# EAGLE design acdcconverter (EAGLE 7.5.0)
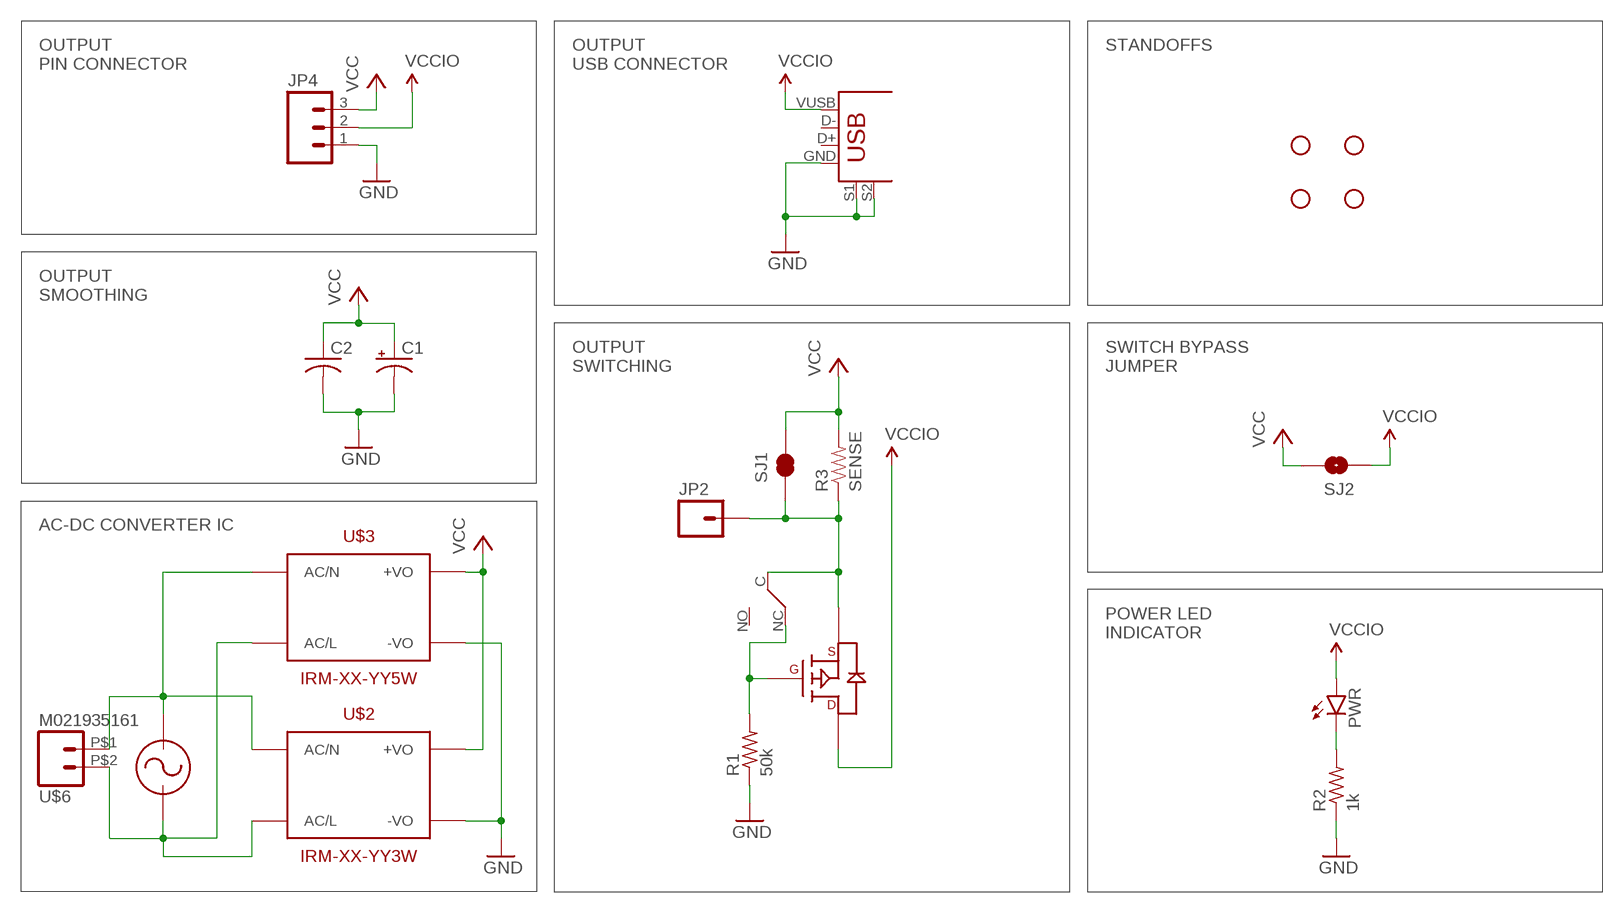
[diagram p0: schematic, sheet 1]

## Parts
C1  CPOL-USE2-5  [E2-5]
C2  C-USC0603  [C0603]
JP2  M01PTH  [1X01]
JP4  M03PTH  [1X03]
PWR  LED0603  [LED-0603]
R1  50k  R-US_R0603  [R0603]
R2  1k  R-US_R0603  [R0603]
R3  SENSE  RESISTOR0805-RES  [0805]
SJ1  JUMPER-PAD-2-NC_BY_TRACE  [PAD-JUMPER-2-NC_BY_TRACE_YES_SILK]
SJ2  SOLDERJUMPERNO  [SJ_2S-NO]
STANDOFF1  STAND-OFF  [STAND-OFF]
STANDOFF2  STAND-OFF  [STAND-OFF]
STANDOFF3  STAND-OFF  [STAND-OFF]
STANDOFF4  STAND-OFF  [STAND-OFF]
U$1  AC-CONNECTOR770W-X2  [770W-X2]
U$2  IRM-XX-YY3W  [IRM-03-YY]
U$3  IRM-XX-YY5W  [IRM-05-YY]
U$5  SWITCH-SPDT  [SWITCH-1825232-1]
U$6  M021935161  [M02-1935161]
U$7  USB-FEMALE  [FOXCONN-113N-USB-A-FEMALE]
U$8  MOSFET-PDMG2305UX  [SOT23-3]

## Nets
AC/L: U$1.P$1(AC1) U$2.AC/L U$3.AC/L U$6.P$2
AC/N: U$1.P$2(AC2) U$2.AC/N U$3.AC/N U$6.P$1
GND: C1.- C2.2 JP4.1 R1.1 R2.1 U$2.-VO U$3.-VO U$7.GND U$7.S1 U$7.S2
N$3: R1.2 U$5.NC U$8.3(GATE)
N$4: JP2.1 R3.1 SJ1.1 U$5.C U$8.1(SOURCE)
N$6: PWR.C R2.2
VCC: C1.+ C2.1 JP4.3 R3.2 SJ1.2 SJ2.2 U$2.+VO U$3.+VO
VCCIO: JP4.2 PWR.A SJ2.1 U$7.VUSB U$8.2(DRAIN)
Unconnected: U$5.NO U$7.D+ U$7.D-

## Notes on the sheet
- OUTPUT
  PIN CONNECTOR
- OUTPUT
  USB CONNECTOR
- STANDOFFS
- OUTPUT
  SMOOTHING
- OUTPUT
  SWITCHING
- SWITCH BYPASS
  JUMPER
- AC-DC CONVERTER IC
- POWER LED
  INDICATOR

## Library data of the parts
C1 = rcl:CPOL-US: POLARIZED CAPACITOR, American symbol
C2 = rcl:C-US: CAPACITOR, American symbol
JP2 = SparkFun-Connectors:M01: Header 1 Standard 1-pin 0.1" header. Use with straight break away headers (SKU : PRT-00116), right angle break away headers (PRT-00553), swiss pins (PRT-00743), machine pins (PRT-00117), and female headers (PRT-00115).
JP4 = SparkFun-Connectors:M03: Header 3 Standard 3-pin 0.1" header. Use with straight break away headers (SKU : PRT-00116), right angle break away headers (PRT-00553), swiss pins (PRT-00743), machine pins (PRT-00117), and female headers (PRT-00115). Molex polarized connector foot print use with SKU : PRT-08232 with associated crimp pins and housings.
PWR = SparkFun-LED:LED: LEDs Standard schematic elements and footprints for 5mm, 3mm, 1206, and 0603 sized LEDs. 5mm - Spark Fun Electronics SKU : COM-00529 (and others)
R1 R2 = resistor:R-US_: RESISTOR, American symbol
R3 = SparkFun-Passives:RESISTOR: Resistor Basic schematic elements and footprints for 0603, 1206, and PTH resistors.
SJ1 = SparkFun-Passives:JUMPER-PAD-2-NC_BY_TRACE
SJ2 = SparkFun-Retired:SOLDERJUMPER: Solder Jumper Standard SMD solder jumper. Used to automate production. Two varients : Normally Open and Normally Closed are the same, but have different paste layers. NC will have a large amount of paste and should jumper during reflow.
STANDOFF1-STANDOFF4 = SparkFun-Electromechanical:STAND-OFF: #4 Stand Off This is the mechanical footprint for a #4 phillips button head screw. Use the keepout ring to avoid running the screw head into surrounding components. SKU : PRT-00447
U$1 = HHJ:AC-CONNECTOR
U$2 U$3 = HHJ:IRM-XX-YY
U$5 = HHJ:SWITCH-SPDT
U$6 = HHJ:M02
U$7 = HHJ:USB-FEMALE
U$8 = HHJ:MOSFET-P

## Board
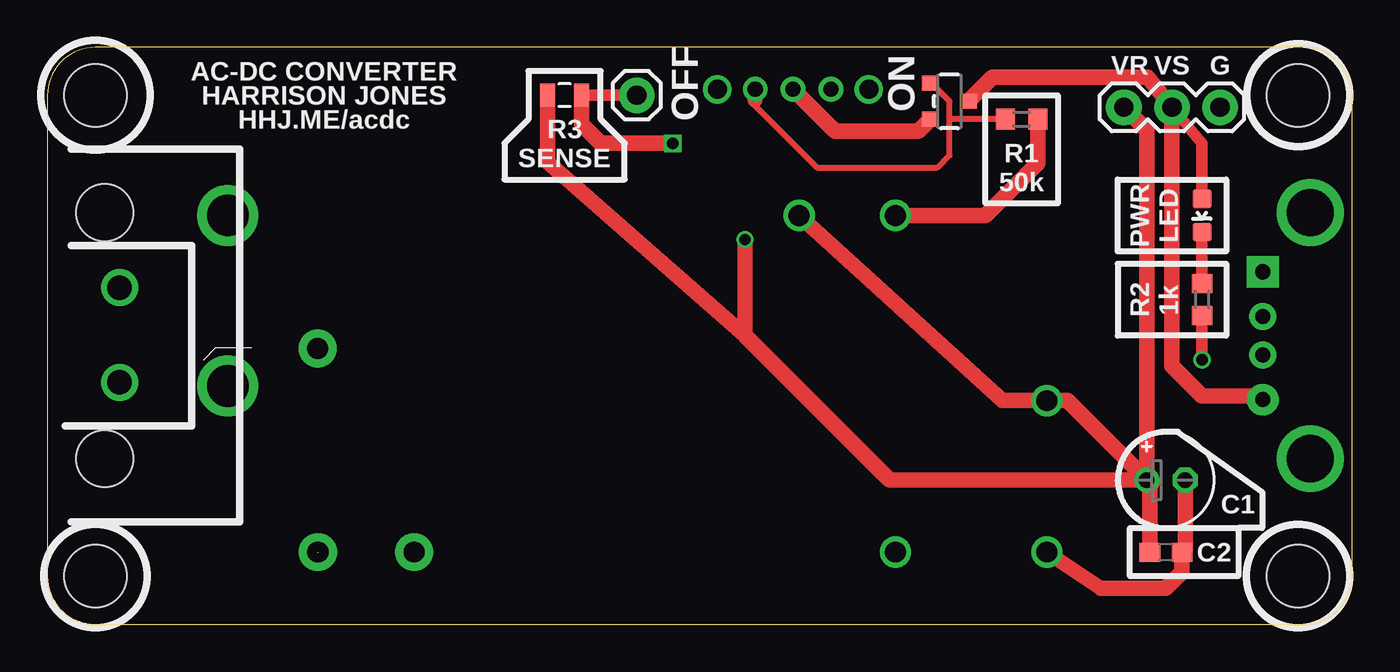
[diagram p1: board, top side]
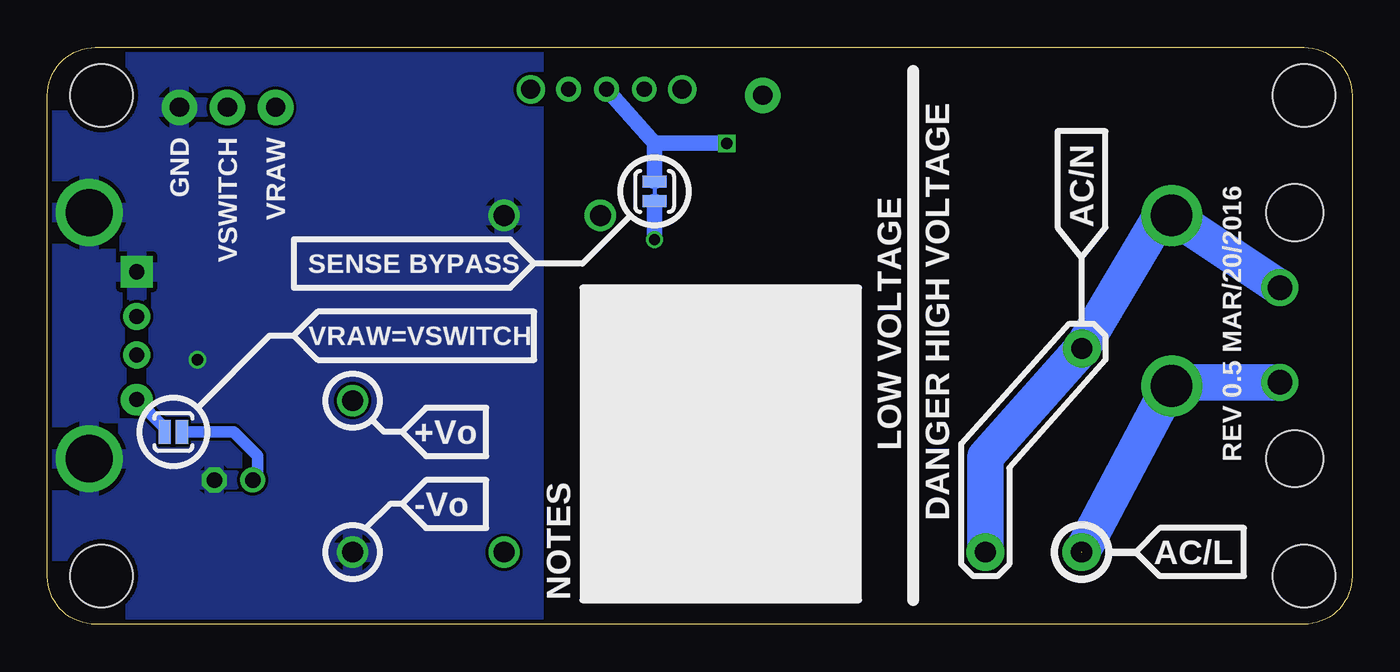
[diagram p2: board, bottom side, seen from below]

Size 68.89 x 30.47 mm. Coordinates in mm from the lower left corner, seen from the top.
Outline: 0,27.93 0,2.54 arc90 2.54,0 66.34,0 arc90 68.89,2.54 68.89,27.93 arc90 66.34,30.47 2.54,30.47 arc90 0,27.93
Copper layers (1*16): Top 0.035mm / dielectric 1.5mm / Bottom 0.035mm
Design rules "SeeedStudio_2layer_DRU_no_angle_20140221": minimum track width 6mil, minimum drill 12mil, track to track 6mil, track to pad 6mil, pad to pad 6mil, via to via 6mil, smd to smd 0mil, copper to edge 10mil, drill to drill 10mil, minimum pad ring 10mil, minimum via ring 6mil, stop-mask expansion 2mil, vias tented up to drill 100mil, thermal gap 10mil

### Footprints (pad centres in the part's own frame; a part is rotated, then mirrored left to right if it is on the bottom)
E2-5 = drill 0.813 pad 1.27: + -1.016,0 | drill 0.813 pad 1.27 octagon: - 1.016,0
C0603 = smd 1.1 x 1: 1 -0.85,0; 2 0.85,0
1X01 = drill 1.016 pad 1.88: 1 0,0
1X03 = drill 1.016 pad 1.88: 1 0,0; 2 2.54,0; 3 5.08,0
LED-0603 = smd 1 x 1: A 0,-0.877; C 0,0.877
R0603 = smd 1 x 1.1: 1 -0.85,0; 2 0.85,0
0805 = smd 0.8 x 1.2: 1 -0.9,0; 2 0.9,0
PAD-JUMPER-2-NC_BY_TRACE_YES_SILK = smd 0.635 x 1.27: 1 -0.508,0; 2 0.508,0
SJ_2S-NO = smd 0.635 x 1.27: 1 -0.45,0; 2 0.45,0
STAND-OFF = hole 3.302: 0,0
770W-X2 = drill 2.2: P$1 -2.65,0; P$2 6.35,0 | hole 3: -6.5,6.5; 6.5,6.5
IRM-03-YY = drill 1.1: +VO -5.08,17.78; -VO 0,17.78; NC 0,0 | drill 1.1 pad 2: AC/L -30.48,0; AC/N -25.4,0
IRM-05-YY = drill 1.1: +VO 0,8; -VO 0,0 | drill 1.1 pad 2: AC/L -38.5,0; AC/N -38.5,10.75
SWITCH-1825232-1 = drill 0.8: C 0,0; NC 2,0; NO -2,0 | drill 1: NC1 -4,0; NC2 4,0
M02-1935161 = drill 1.3: P$1 0,0; P$2 5,0
FOXCONN-113N-USB-A-FEMALE = drill 0.8 pad 1.422: D+ 1.02,2.51; D- -1.02,2.51 | drill 0.8 pad 1.676 square: GND 3.375,2.5 | drill 2.5: S1 -6.5,0; S2 6.5,0 | drill 0.8 pad 1.676: VUSB -3.375,2.5
SOT23-3 = smd 0.8 x 0.9: 1 -0.95,1; 2 0,-1; 3 0.95,1

### Placement (x,y rotation side)
C1  59.05,7.62 0 top
C2  59.05,3.81 0 top
JP2  31.11,27.94 0 top
JP4  61.91,27.3 180 top
PWR  60.96,21.59 180 top
R1  51.44,26.67 180 top
R2  60.96,17.14 90 top
R3  27.3,27.94 180 top
SJ1  36.83,22.86 270 bottom
SJ2  62.23,10.16 0 bottom
STANDOFF1  2.54,27.94 0 top
STANDOFF2  2.54,2.54 0 top
STANDOFF3  66.04,2.54 0 top
STANDOFF4  66.04,27.94 0 top
U$1  9.53,15.24 90 top
U$2  44.77,3.81 0 top
U$3  52.77,3.81 0 top
U$5  39.37,28.26 180 top
U$6  3.81,17.78 270 top
U$7  66.67,15.24 90 top
U$8  47.62,27.62 90 top

### Tracks (layer width: path | path; a pad name or v marks a point on that pad's centre or on a via)
AC/L  (1 unrouted)
  Bottom 1.93: U$3.AC/L 9.62,12.59 U$1.P$1 9.34,12.78 U$6.P$2
AC/N
  Bottom 1.93: U$2.AC/N 19.37,8.83 U$3.AC/N 10.1,21.59 U$1.P$2 U$6.P$1
GND  (via drill 0.6)
  Top 0.61: R2.1 v60.96,13.97
  Top 0.813: U$3.-VO 55.63,1.91 59.05,1.91 59.91,2.75 C2.2 60.07,3.98 C1.- | U$2.-VO 49.53,21.59 52.28,24.34 R1.1
  pour Bottom: 43.18,31.75 73.66,31.75 73.66,-2.54 43.18,-2.54
N$3
  Top 0.305: U$8.3 46.67,28.57 47.62,27.62 47.62,26.67 | 37.37,27.72 37.37,27.4 40.64,24.13 46.99,24.13 47.62,24.77 47.62,26.67 | R1.2 47.62,26.67
  Top 0.813: U$5.NC 37.37,27.72
N$4  (via drill 0.6)
  Top 0.61: R3.1 JP2.1
  Top 0.813: R3.1 28.2,26.41 29.21,25.4 v33.02,25.4 | U$5.C 41.59,26.04 45.99,26.04 U$8.1
  Bottom 0.813: SJ1.1 36.83,25.4 | 36.83,25.4 U$5.C | v33.02,25.4 36.83,25.4
N$6
  Top 0.61: PWR.C R2.2
VCC  (via drill 0.6)
  Top 0.813: U$2.+VO 50.42,11.81 U$3.+VO 53.85,11.81 C1.+ | 58.2,7.45 C2.1 | R3.2 26.41,24.39 36.83,15.24 | 36.83,15.24 44.45,7.62 C1.+ | v36.83,20.32 36.83,15.24 | 57.15,8.51 C1.+ | 56.96,27.18 JP4.3 58.04,26.1 C1.+
  Top 1.016: C1.+ 58.2,7.45
  Bottom 0.61: SJ2.2 59.05,10.16 57.78,8.89 57.78,7.87 C1.+
  Bottom 0.813: SJ1.2 v36.83,20.32
VCCIO
  Top 0.61: PWR.A 60.96,25.4 JP4.2
  Top 0.813: U$7.VUSB 63.98,12.06 60.96,12.06 59.37,13.65 JP4.2 58.1,28.89 49.89,28.89 U$8.2
  Bottom 0.61: SJ2.1 62.68,10.37 U$7.VUSB

### Text on the board
tPlace: VR | VS | G | AC-DC CONVERTER | OFF | ON | HARRISON JONES | HHJ.ME/acdc | R3 / SENSE | R1 / 50k | PWR / LED | R2 / 1k | C1 | C2
bPlace: VRAW | VSWITCH | GND | AC/N | SENSE BYPASS | DANGER HIGH VOLTAGE | REV 0.5 MAR/20/2016 | LOW VOLTAGE | VRAW=VSWITCH | +Vo | -Vo | AC/L | NOTES